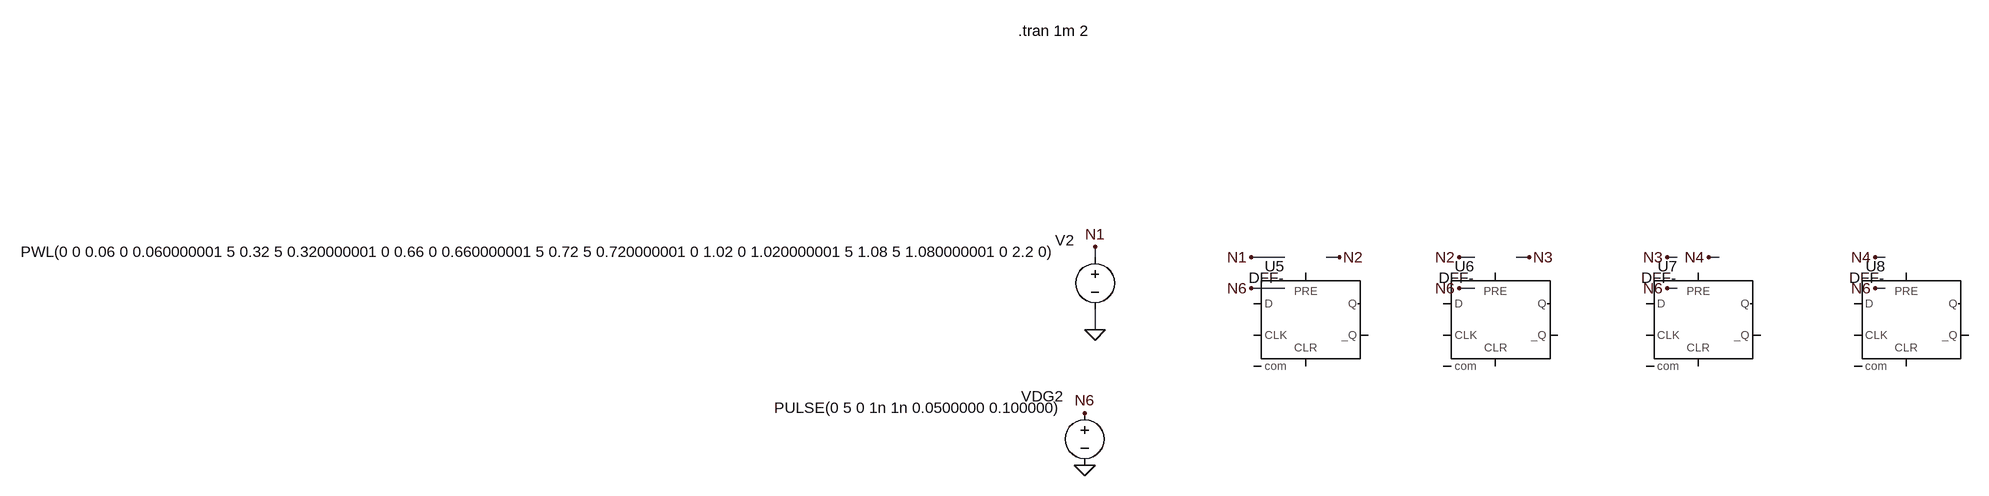
[diagram p0: schematic 6_3_1_Schieberegister_Prinzip.asc]
6_3_1_Schieberegister_Prinzip.asc, the LTspice schematic file:
Version 4
SHEET 1 880 680
WIRE 128 560 128 544
WIRE 128 544 128 528
WIRE 688 448 712 448
WIRE 504 448 484 448
WIRE 1008 448 1024 448
WIRE 796 448 776 448
WIRE 1328 448 1344 448
WIRE 1072 448 1088 448
WIRE 1328 496 1344 496
WIRE 688 496 712 496
WIRE 368 496 420 496
WIRE 1008 496 1024 496
WIRE 128 432 128 448
WIRE 368 448 420 448
FLAG 112 768 0
FLAG 128 560 0
FLAG 688 448 N2
FLAG 504 448 N2
FLAG 1008 448 N3
FLAG 796 448 N3
FLAG 1328 448 N4
FLAG 1072 448 N4
FLAG 1328 496 N6
FLAG 688 496 N6
FLAG 368 496 N6
FLAG 112 688 N6
FLAG 1008 496 N6
FLAG 128 432 N1
FLAG 368 448 N1
SYMBOL Digital\dflop 452 472 R0
WINDOW 0 -32 -10 Right 2
WINDOW 3 -32 8 Right 2
SYMATTR InstName U5
SYMATTR Value DFF-
SYMATTR LibreSpice kind=dff;edge=falling;async=high;vth=2.5;vhigh=5;pins=D,CLK,SET,RESET,Q,~Q
SYMBOL Digital\dflop 744 472 R0
WINDOW 0 -32 -10 Right 2
WINDOW 3 -32 8 Right 2
SYMATTR InstName U6
SYMATTR Value DFF-
SYMATTR LibreSpice kind=dff;edge=falling;async=high;vth=2.5;vhigh=5;pins=D,CLK,SET,RESET,Q,~Q
SYMBOL Digital\dflop 1056 472 R0
WINDOW 0 -32 -10 Right 2
WINDOW 3 -32 8 Right 2
SYMATTR InstName U7
SYMATTR Value DFF-
SYMATTR LibreSpice kind=dff;edge=falling;async=high;vth=2.5;vhigh=5;pins=D,CLK,SET,RESET,Q,~Q
SYMBOL Digital\dflop 1376 472 R0
WINDOW 0 -32 -10 Right 2
WINDOW 3 -32 8 Right 2
SYMATTR InstName U8
SYMATTR Value DFF-
SYMATTR LibreSpice kind=dff;edge=falling;async=high;vth=2.5;vhigh=5;pins=D,CLK,SET,RESET,Q,~Q
SYMBOL voltage 112 672 R0
WINDOW 0 -32 -10 Right 2
WINDOW 3 -32 8 Right 2
SYMATTR InstName VDG2
SYMATTR Value PULSE(0 5 0 1n 1n 0.0500000 0.100000)
SYMBOL voltage 128 432 R0
WINDOW 0 -32 -10 Right 2
WINDOW 3 -32 8 Right 2
SYMATTR InstName V2
SYMATTR Value PWL(0 0 0.06 0 0.060000001 5 0.32 5 0.320000001 0 0.66 0 0.660000001 5 0.72 5 0.720000001 0 1.02 0 1.020000001 5 1.08 5 1.080000001 0 2.2 0)
TEXT 10 100 Left 2 !.tran 1m 2

The netlist it stands for:
* 6_3_1_Schieberegister_Prinzip.asc
A§U5 0 0 0 0 0 0 0 0 DFLOP DFF-
A§U6 0 0 0 0 0 0 0 0 DFLOP DFF-
A§U7 0 0 0 0 0 0 0 0 DFLOP DFF-
A§U8 0 0 0 0 0 0 0 0 DFLOP DFF-
VDG2 N6 0 PULSE(0 5 0 1n 1n 0.0500000 0.100000)
V2 N1 0 PWL(0 0 0.06 0 0.060000001 5 0.32 5 0.320000001 0 0.66 0 0.660000001 5 0.72 5 0.720000001 0 1.02 0 1.020000001 5 1.08 5 1.080000001 0 2.2 0)
.tran 1m 2
.backanno
.end